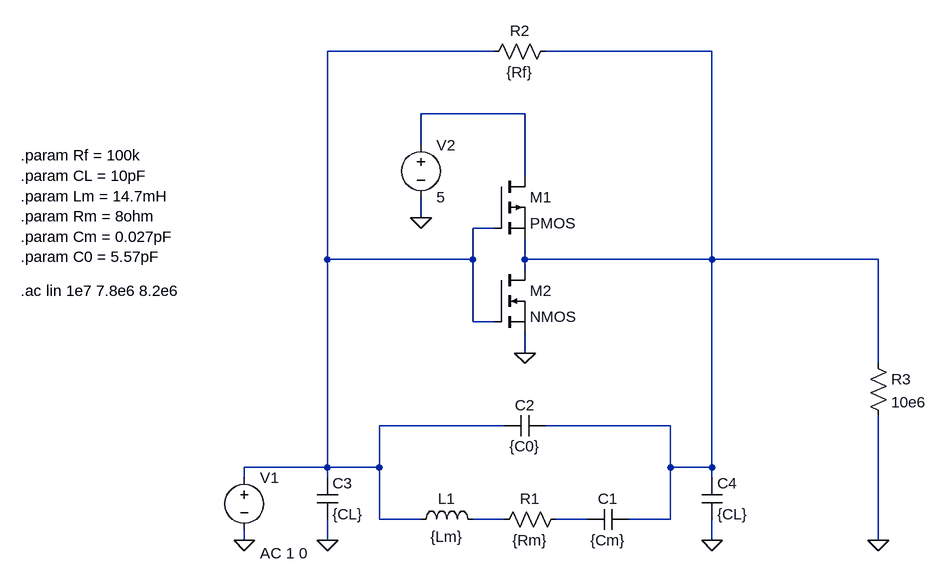
[diagram p0: schematic Oscillator.asc]
Oscillator.asc, the LTspice schematic file:
Version 4
SHEET 1 880 680
WIRE 96 -544 -160 -544
WIRE 432 -544 176 -544
WIRE 144 -448 -16 -448
WIRE -16 -400 -16 -448
WIRE 144 -352 144 -448
WIRE -16 -288 -16 -320
WIRE 96 -272 64 -272
WIRE -160 -224 -160 -544
WIRE 64 -224 64 -272
WIRE 64 -224 -160 -224
WIRE 144 -224 144 -256
WIRE 432 -224 432 -544
WIRE 432 -224 144 -224
WIRE 688 -224 432 -224
WIRE 144 -208 144 -224
WIRE 64 -128 64 -224
WIRE 96 -128 64 -128
WIRE 144 -80 144 -112
WIRE 688 -64 688 -224
WIRE 112 32 -80 32
WIRE 368 32 176 32
WIRE -160 96 -160 -224
WIRE -160 96 -288 96
WIRE -80 96 -80 32
WIRE -80 96 -160 96
WIRE 368 96 368 32
WIRE 432 96 432 -224
WIRE 432 96 368 96
WIRE -288 112 -288 96
WIRE -160 112 -160 96
WIRE 432 112 432 96
WIRE -80 176 -80 96
WIRE -16 176 -80 176
WIRE 112 176 64 176
WIRE 240 176 192 176
WIRE 368 176 368 96
WIRE 368 176 304 176
WIRE -288 208 -288 192
WIRE -160 208 -160 176
WIRE 432 208 432 176
WIRE 688 208 688 16
FLAG 432 208 0
FLAG -160 208 0
FLAG -288 208 0
FLAG 144 -80 0
FLAG -16 -288 0
FLAG 688 208 0
SYMBOL res 96 192 R270
WINDOW 0 32 56 VTop 0
WINDOW 3 0 56 VBottom 0
SYMATTR InstName R1
SYMATTR Value {Rm}
SYMBOL ind -32 192 R270
WINDOW 0 32 56 VTop 0
WINDOW 3 5 56 VBottom 0
SYMATTR InstName L1
SYMATTR Value {Lm}
SYMBOL cap 240 192 R270
WINDOW 0 32 32 VTop 0
WINDOW 3 0 32 VBottom 0
SYMATTR InstName C1
SYMATTR Value {Cm}
SYMBOL cap 112 48 R270
WINDOW 0 32 32 VTop 0
WINDOW 3 0 32 VBottom 0
SYMATTR InstName C2
SYMATTR Value {C0}
SYMBOL cap -176 112 R0
SYMATTR InstName C3
SYMATTR Value {CL}
SYMBOL cap 416 112 R0
SYMATTR InstName C4
SYMATTR Value {CL}
SYMBOL voltage -288 96 R0
WINDOW 123 24 132 Left 0
WINDOW 39 0 0 Left 0
SYMATTR InstName V1
SYMATTR Value ""
SYMATTR Value2 AC 1 0
SYMBOL pmos 96 -352 R0
SYMATTR InstName M1
SYMBOL nmos 96 -208 R0
SYMATTR InstName M2
SYMBOL voltage -16 -416 R0
WINDOW 123 0 0 Left 0
WINDOW 39 0 0 Left 0
SYMATTR InstName V2
SYMATTR Value 5
SYMBOL res 80 -528 R270
WINDOW 0 32 56 VTop 0
WINDOW 3 0 56 VBottom 0
SYMATTR InstName R2
SYMATTR Value {Rf}
SYMBOL res 672 -80 R0
SYMATTR InstName R3
SYMATTR Value 10e6
TEXT -632 -384 Left 0 !.param Rf = 100k\n.param CL = 10pF\n.param Lm = 14.7mH\n.param Rm = 8ohm\n.param Cm = 0.027pF\n.param C0 = 5.57pF
TEXT -632 -176 Left 0 !.ac lin 1e7 7.8e6 8.2e6

The netlist it stands for:
* Oscillator.asc
R1 N004 N005 {Rm}
L1 N001 N004 {Lm}
C1 N005 N002 {Cm}
C2 N001 N002 {C0}
C3 N001 0 {CL}
C4 N002 0 {CL}
V1 N001 0 AC 1 0
M1 N003 N001 N002 N002 PMOS
M2 N002 N001 0 0 NMOS
V2 N003 0 5
R2 N001 N002 {Rf}
R3 N002 0 10e6
.model NMOS NMOS
.model PMOS PMOS
.lib standard.mos
.param Rf = 100k
.param CL = 10pF
.param Lm = 14.7mH
.param Rm = 8ohm
.param Cm = 0.027pF
.param C0 = 5.57pF
.ac lin 1e7 7.8e6 8.2e6
.backanno
.end